# Altium project Modulers-AVR-connect.PrjPcb
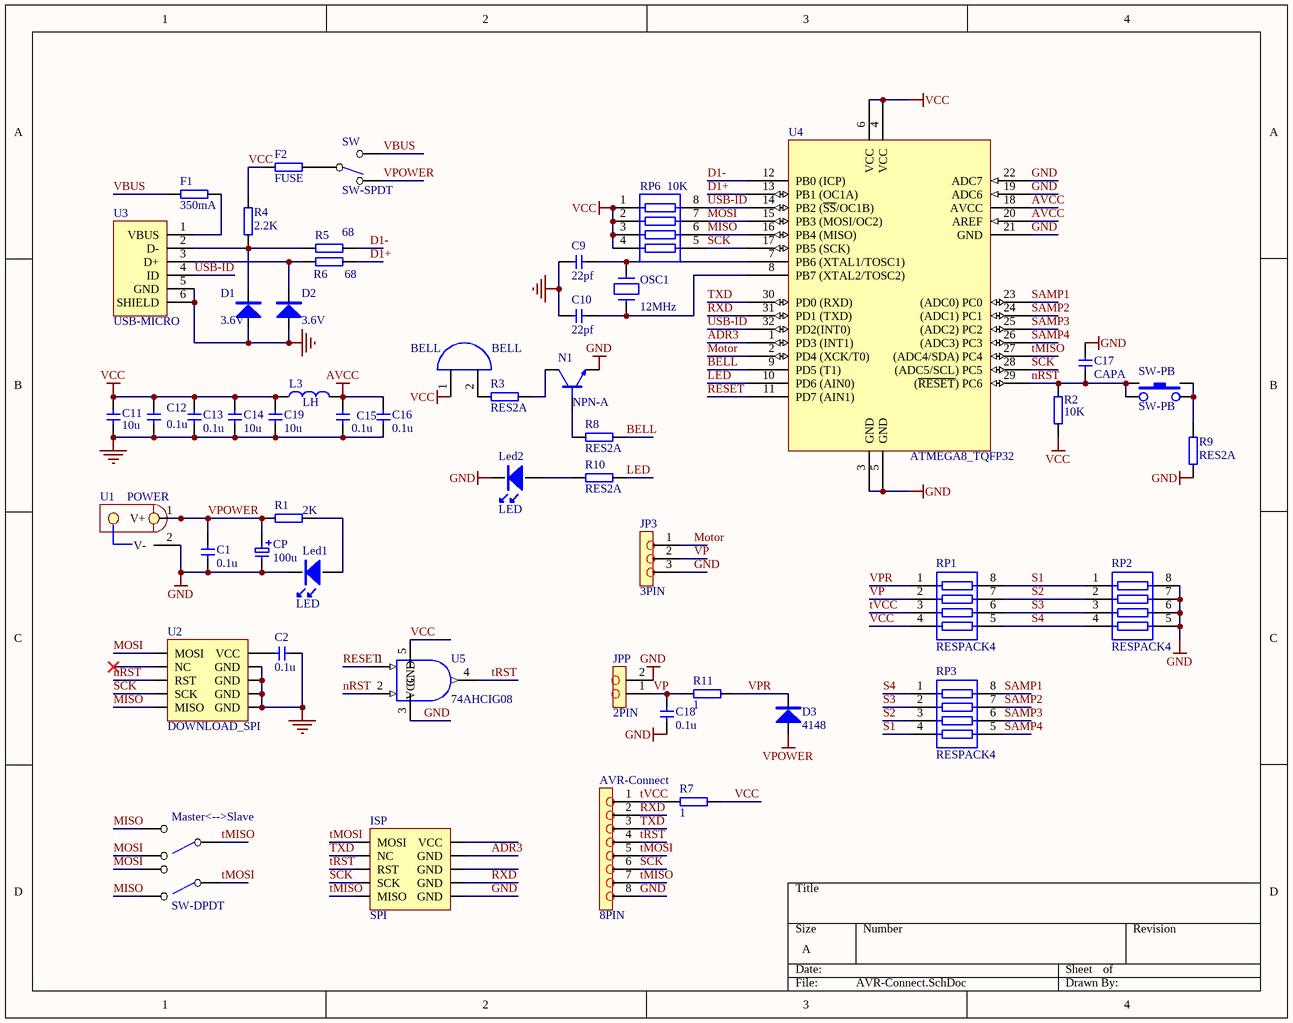
[diagram p0: AVR-Connect.SchDoc]
1 sheet, 52 parts. Net scope: global (net labels, ports and power ports of the same name join across sheets).
Board file: AVR-Connect.PcbDoc

## Sheet AVR-Connect.SchDoc
size A

### Parts
AVR-Connect  8PIN  [SIP8]
BELL  BELL  [Bell]
C1  0.1u  [RC100]
C2  0.1u  [RC100]
C9  22pf  [RC100]
C10  22pf  [RC100]
C11  10u  [RC100]
C12  0.1u  [RC100]
C13  0.1u  [RC100]
C14  10u  [RC100]
C15  0.1u  [RC100]
C16  0.1u  [RC100]
C17  CAPA  [RC100]
C18  0.1u  [RC100]
C19  10u  [0805]
CP  100u  [CP+140]
D1  3.6V  [DC140]
D2  3.6V  [DC140]
D3  4148  [DC140]
F1  350mA  [0805]
F2  FUSE  [0805]
ISP  SPI  [DOWNLOAD-RC]
JP3  3PIN  [SIP3]
JPP  2PIN  [SIP2]
L3  LH  [1206]
Led1  LED  [LED]
Led2  LED  [LED]
Master<-->Slave  SW-DPDT  [SW-DPDT]
N1  NPN-A  [SOT-23A]
OSC1  12MHz  [OSC200]
R1  2K  [0805]
R2  10K  [0805]
R3  RES2A  [0805]
R4  2.2K  [0805]
R5  68  [0805]
R6  68  [0805]
R7  1  [0805]
R8  RES2A  [0805]
R9  RES2A  [0805]
R10  RES2A  [0805]
R11  1  [0805]
RP1  RESPACK4  [RN4]
RP2  RESPACK4  [RN4]
RP3  RESPACK4  [RN4]
RP6  10K  [RN4]
SW  SW-SPDT  [SW-SPDT]
SW-PB  SW-PB  [SW-PB]
U1  POWER  [POWER-L]
U2  DOWNLOAD_SPI  [DOWNLOAD]
U3  USB-MICRO  [USB-MICRO-R]
U4  ATMEGA8_TQFP32  [TQFP-32]
U5  74AHCIG08  [SOP-5]

### Nets
AVCC: C15.1 C16.1 L3.2 U4.18(AVCC) U4.20(AREF)
GND: AVR-Connect.8 C1.1 C2.2 C9.1 C10.1 C11.2 C12.2 C13.2 C14.2 C15.2 C16.2 C17.1 C18.2 C19.2 CP.2 D1.A D2.A ISP.10(GND) JP3.3 JPP.2 Led1.K Led2.K N1.E R9.1 RP2.5 RP2.6 RP2.7 RP2.8 U1.2(V-) U2.4(GND) U2.6(GND) U2.8(GND) U2.10(GND) U3.5(GND) U3.6(SHIELD) U4.3(GND) U4.5(GND) U4.19(ADC6) U4.21(GND) U4.22(ADC7) U5.3(GND)
VCC: BELL.1 C11.1 C12.1 C13.1 C14.1 C19.1 F2.1 L3.1 R2.2 R4.2 R7.2 RP1.4 RP6.1 RP6.2 RP6.3 RP6.4 U4.4(VCC) U4.6(VCC) U5.5(VCC)
VPOWER: C1.2 CP.1 D3.A R1.1 SW.3 U1.1(V+)
ADR3: ISP.4(GND) U4.1(PD3_(INT1))
BELL: R8.1 U4.9(PD5_(T1))
D1+: R6.2 U4.13(PB1_(OC1A))
D1-: R5.2 U4.12(PB0_(ICP))
LED: R10.2 U4.10(PD6_(AIN0))
MISO: Master<-->Slave.2 Master<-->Slave.6 RP6.6 U2.9(MISO) U4.16(PB4_(MISO))
MOSI: Master<-->Slave.3 Master<-->Slave.5 RP6.7 U2.1(MOSI) U4.15(PB3_(MOSI/OC2))
Motor: JP3.1 U4.2(PD4_(XCK/T0))
nRST: C17.2 R2.1 SW-PB.1 SW-PB.3 U2.5(RST) U4.29((~{RESET})_PC6) U5.2
RESET: U4.11(PD7_(AIN1)) U5.1
RXD: AVR-Connect.2 ISP.8(GND) U4.31(PD1_(TXD))
S1: RP1.8 RP2.1 RP3.4
S2: RP1.7 RP2.2 RP3.3
S3: RP1.6 RP2.3 RP3.2
S4: RP1.5 RP2.4 RP3.1
SAMP1: RP3.8 U4.23((ADC0)_PC0)
SAMP2: RP3.7 U4.24((ADC1)_PC1)
SAMP3: RP3.6 U4.25((ADC2)_PC2)
SAMP4: RP3.5 U4.26((ADC3)_PC3)
SCK: AVR-Connect.6 ISP.7(SCK) RP6.5 U2.7(SCK) U4.17(PB5_(SCK)) U4.28((ADC5/SCL)_PC5)
tMISO: AVR-Connect.7 ISP.9(MISO) Master<-->Slave.4 U4.27((ADC4/SDA)_PC4)
tMOSI: AVR-Connect.5 ISP.1(MOSI) Master<-->Slave.1
tRST: AVR-Connect.4 ISP.5(RST) U5.4
tVCC: AVR-Connect.1 R7.1 RP1.3
TXD: AVR-Connect.3 ISP.3(NC) U4.30(PD0_(RXD))
USB-ID: RP6.8 U3.4(ID) U4.14(PB2_(~{SS}/OC1B)) U4.32(PD2(INT0))
VBUS: F1.1 SW.1
VP: C18.1 JP3.2 JPP.1 R11.1 RP1.2
VPR: D3.K R11.2 RP1.1
NetBELL_2: BELL.2 R3.1
NetC2_1: C2.1 U2.2(VCC)
NetC9_2: C9.2 OSC1.2 U4.7(PB6_(XTAL1/TOSC1))
NetC10_2: C10.2 OSC1.1 U4.8(PB7_(XTAL2/TOSC2))
NetD1_K: D1.K R4.1 R5.1 U3.2(D-)
NetD2_K: D2.K R6.1 U3.3(D+)
NetF1_2: F1.2 U3.1(VBUS)
NetF2_2: F2.2 SW.2
NetLed1_A: Led1.A R1.2
NetLed2_A: Led2.A R10.1
NetN1_B: N1.B R8.2
NetN1_C: N1.C R3.2
NetR9_2: R9.2 SW-PB.2 SW-PB.4

Not connected (* = marked no-connect by the designer): ISP 2(VCC) 6(GND); U2 3(NC)*

### Library data of the parts
C1 C2 C9-C16 C18 C19 = CAPA
CP = CAP+
D1-D3 = DIODE
F1 = FUSE
OSC1 = CRYSTAL
R1 R2 R4-R7 R11 = RES2A
RP6 = RESPACK4
U4 = ATMEGA8_TQFP32: Atmel Microcontroller - Library created by carel..  <www.mpfreezone.com>